# Altium schematic sheet Sheet1.SchDoc
size A4; SheetNumber: 1; SheetTotal: 1
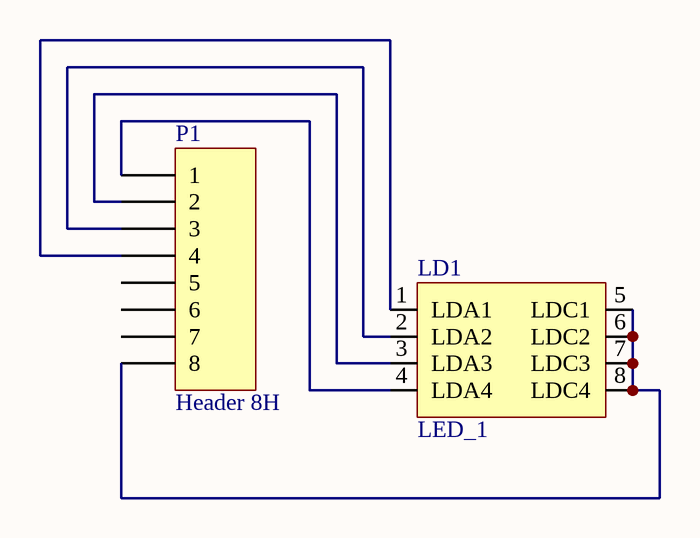
[diagram p0: Sheet1.SchDoc]

## Parts
LD1  LED_1  [LED_1]
P1  Header 8H  [HDR1X8H]

## Nets
NetLD1_1: LD1.1(LDA1) P1.4
NetLD1_2: LD1.2(LDA2) P1.3
NetLD1_3: LD1.3(LDA3) P1.2
NetLD1_4: LD1.4(LDA4) P1.1
NetLD1_5: LD1.5(LDС1) LD1.6(LDC2) LD1.7(LDC3) LD1.8(LDC4) P1.8

Not connected (* = marked no-connect by the designer): P1 5 6 7

## Library data of the parts
P1 = Header 8H: Header, 8-Pin, Right Angle; LatestRevisionDate: 17-Jul-2002; LatestRevisionNote: Re-released for DXP Platform.; Publisher: Altium Limited